# EAGLE design LED Heart (EAGLE 7.3.0)

## Sheet 1 of 2
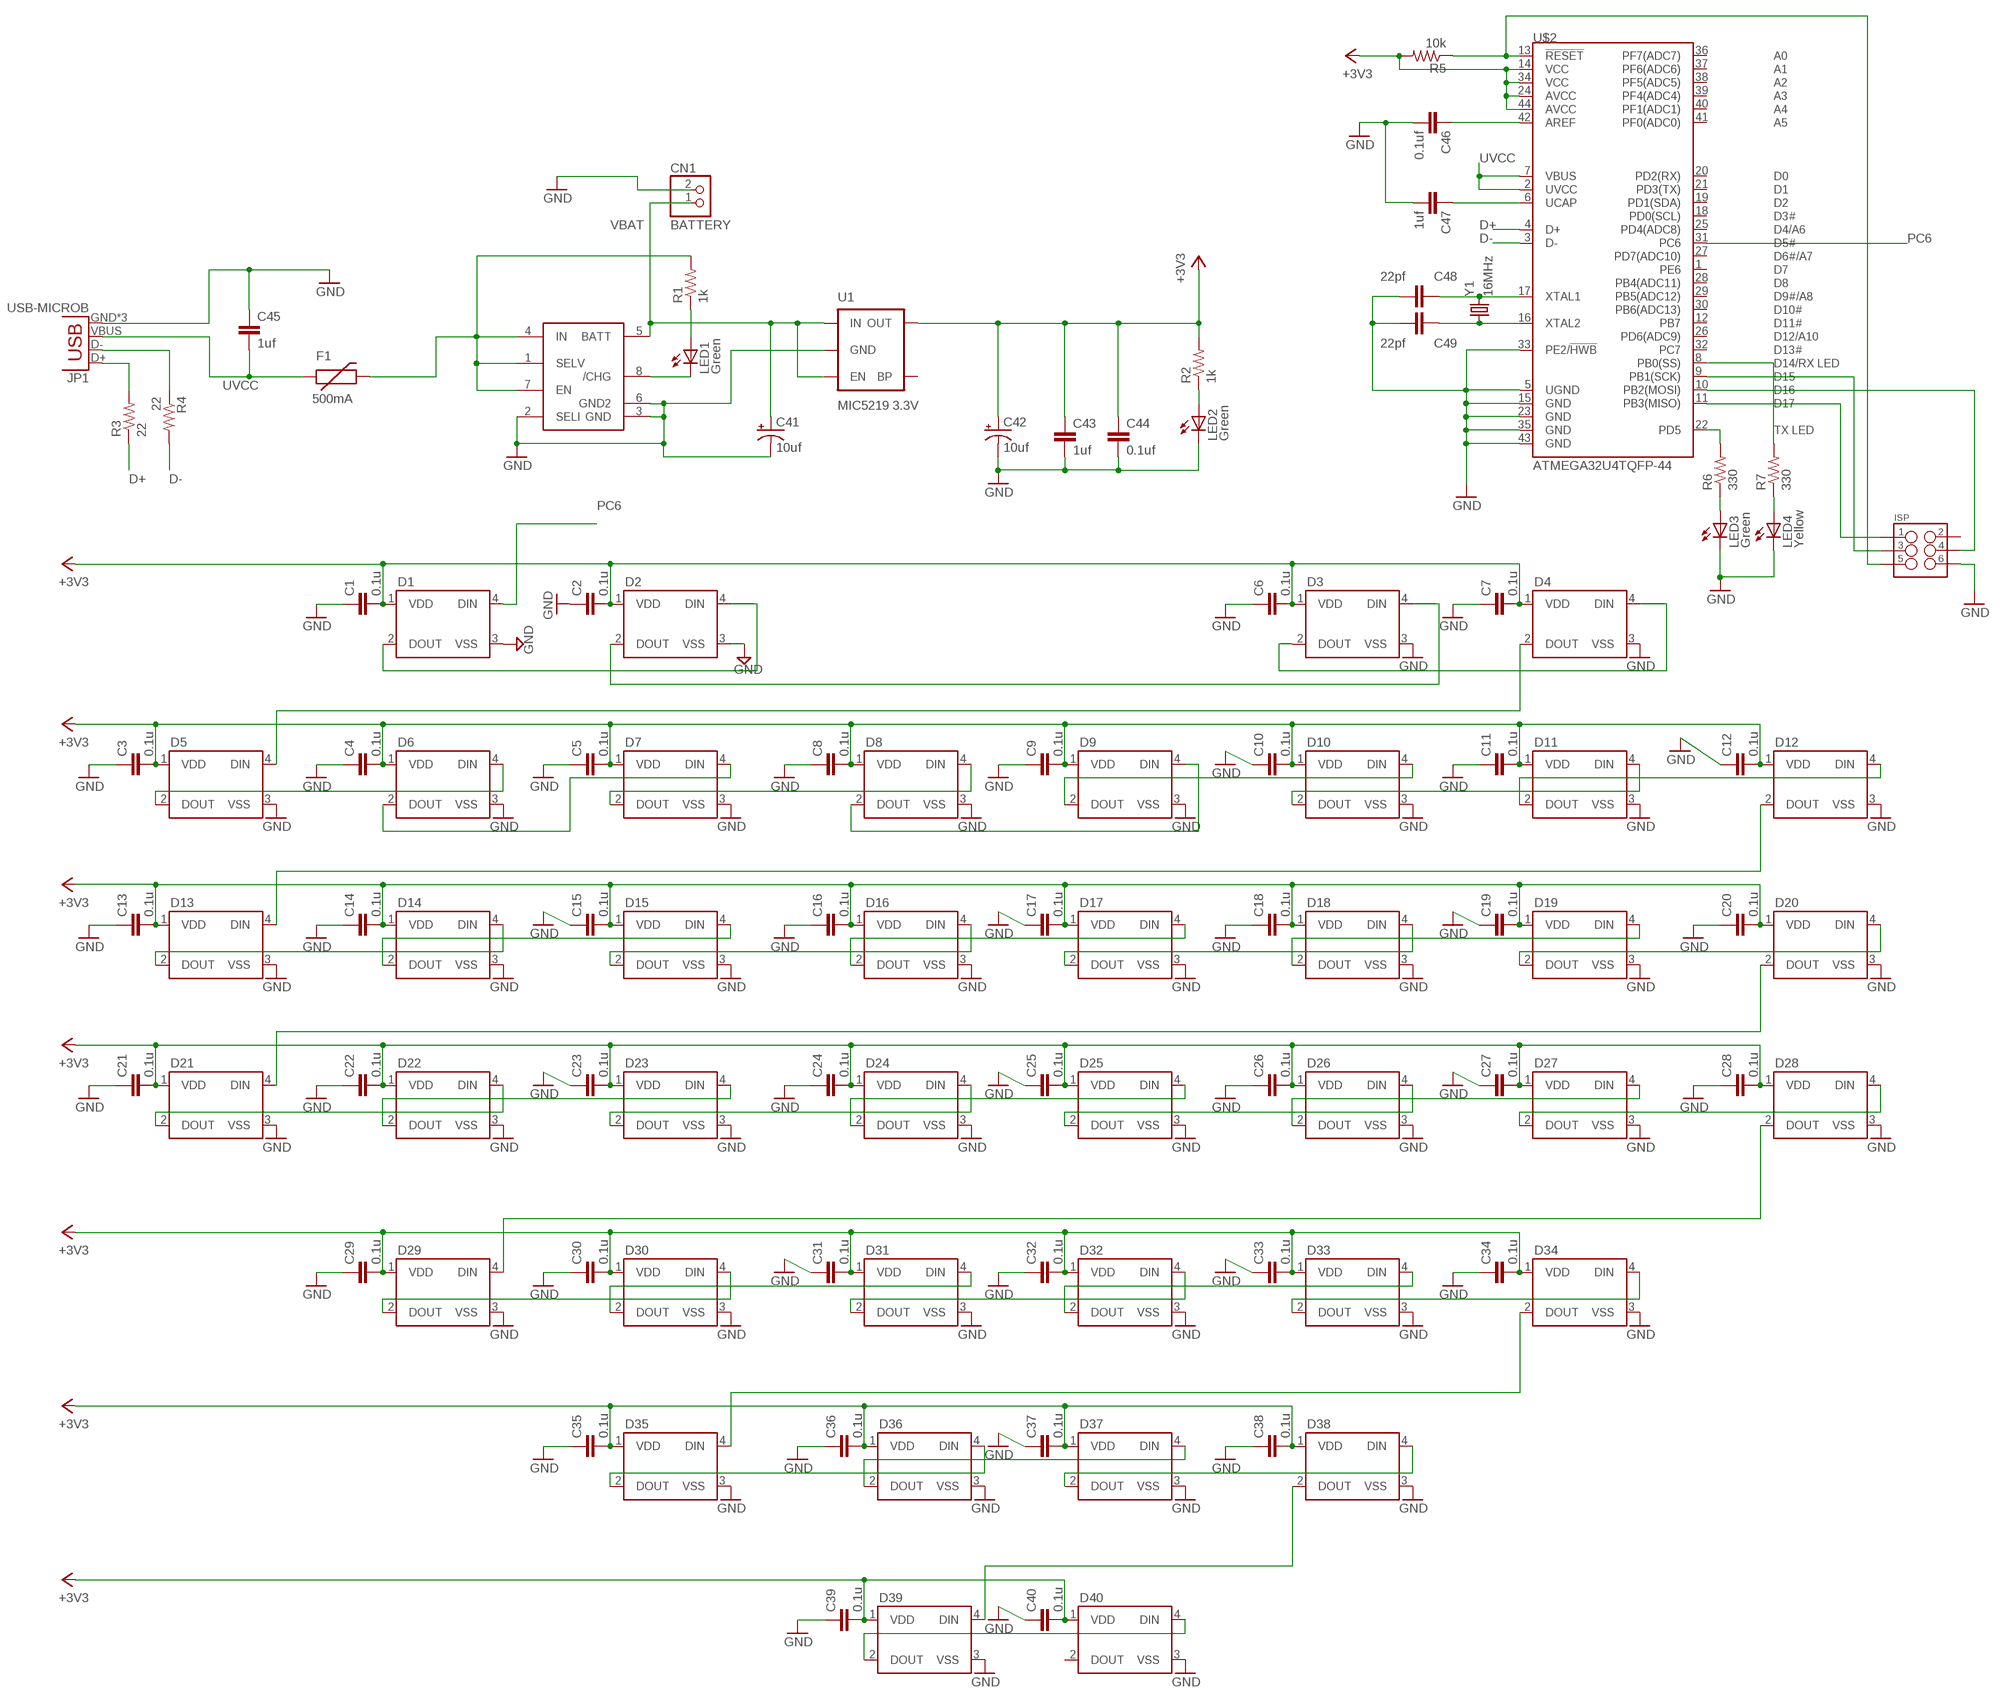
[diagram p0: schematic, sheet 1]

### Parts
C1  0.1u  CAP0805  [0805]
C2  0.1u  CAP0805  [0805]
C3  0.1u  CAP0805  [0805]
C4  0.1u  CAP0805  [0805]
C5  0.1u  CAP0805  [0805]
C6  0.1u  CAP0805  [0805]
C7  0.1u  CAP0805  [0805]
C8  0.1u  CAP0805  [0805]
C9  0.1u  CAP0805  [0805]
C10  0.1u  CAP0805  [0805]
C11  0.1u  CAP0805  [0805]
C12  0.1u  CAP0805  [0805]
C13  0.1u  CAP0805  [0805]
C14  0.1u  CAP0805  [0805]
C15  0.1u  CAP0805  [0805]
C16  0.1u  CAP0805  [0805]
C17  0.1u  CAP0805  [0805]
C18  0.1u  CAP0805  [0805]
C19  0.1u  CAP0805  [0805]
C20  0.1u  CAP0805  [0805]
C21  0.1u  CAP0805  [0805]
C22  0.1u  CAP0805  [0805]
C23  0.1u  CAP0805  [0805]
C24  0.1u  CAP0805  [0805]
C25  0.1u  CAP0805  [0805]
C26  0.1u  CAP0805  [0805]
C27  0.1u  CAP0805  [0805]
C28  0.1u  CAP0805  [0805]
C29  0.1u  CAP0805  [0805]
C30  0.1u  CAP0805  [0805]
C31  0.1u  CAP0805  [0805]
C32  0.1u  CAP0805  [0805]
C33  0.1u  CAP0805  [0805]
C34  0.1u  CAP0805  [0805]
C35  0.1u  CAP0805  [0805]
C36  0.1u  CAP0805  [0805]
C37  0.1u  CAP0805  [0805]
C38  0.1u  CAP0805  [0805]
C39  0.1u  CAP0805  [0805]
C40  0.1u  CAP0805  [0805]
C41  10uf  CAP_POL1206  [EIA3216]
C42  10uf  CAP_POL1206  [EIA3216]
C43  1uf  CAP0805  [0805]
C44  0.1uf  CAP0805  [0805]
C45  1uf  CAP0805  [0805]
C46  0.1uf  CAP0805  [0805]
C47  1uf  CAP0805  [0805]
C48  22pf  CAP0805  [0805]
C49  22pf  CAP0805  [0805]
CN1  BATTERY  JST_2PIN-SMT  [JST-PH-2-SMT]
D1  WS2812B  [WS2812B]
D2  WS2812B  [WS2812B]
D3  WS2812B  [WS2812B]
D4  WS2812B  [WS2812B]
D5  WS2812B  [WS2812B]
D6  WS2812B  [WS2812B]
D7  WS2812B  [WS2812B]
D8  WS2812B  [WS2812B]
D9  WS2812B  [WS2812B]
D10  WS2812B  [WS2812B]
D11  WS2812B  [WS2812B]
D12  WS2812B  [WS2812B]
D13  WS2812B  [WS2812B]
D14  WS2812B  [WS2812B]
D15  WS2812B  [WS2812B]
D16  WS2812B  [WS2812B]
D17  WS2812B  [WS2812B]
D18  WS2812B  [WS2812B]
D19  WS2812B  [WS2812B]
D20  WS2812B  [WS2812B]
D21  WS2812B  [WS2812B]
D22  WS2812B  [WS2812B]
D23  WS2812B  [WS2812B]
D24  WS2812B  [WS2812B]
D25  WS2812B  [WS2812B]
D26  WS2812B  [WS2812B]
D27  WS2812B  [WS2812B]
D28  WS2812B  [WS2812B]
D29  WS2812B  [WS2812B]
D30  WS2812B  [WS2812B]
D31  WS2812B  [WS2812B]
D32  WS2812B  [WS2812B]
D33  WS2812B  [WS2812B]
D34  WS2812B  [WS2812B]
D35  WS2812B  [WS2812B]
D36  WS2812B  [WS2812B]
D37  WS2812B  [WS2812B]
D38  WS2812B  [WS2812B]
D39  WS2812B  [WS2812B]
D40  WS2812B  [WS2812B]
F1  500mA  PTCSMD  [PTC-1206]
ISP  M03X2POGO_PINS  [2X3_POGO]
JP1  USB-MICROB  [USB-MICROB]
LED1  Green  LEDCHIP-LED0805  [CHIP-LED0805]
LED2  Green  LEDCHIP-LED0805  [CHIP-LED0805]
LED3  Green  LEDCHIP-LED0805  [CHIP-LED0805]
LED4  Yellow  LEDCHIP-LED0805  [CHIP-LED0805]
R1  1k  RESISTOR0805-RES  [0805]
R2  1k  RESISTOR0805-RES  [0805]
R3  22  RESISTOR0805-RES  [0805]
R4  22  RESISTOR0805-RES  [0805]
R5  10k  RESISTOR0805-RES  [0805]
R6  330  RESISTOR0805-RES  [0805]
R7  330  RESISTOR0805-RES  [0805]
U1  MIC5219 3.3V  V_REG_MIC52193.3V  [SOT23-5]
U$1  MAX1811SO8  [SO08]
U$2  ATMEGA32U4TQFP-44  [TQFP44]
Y1  16MHz  CRYSTAL7X57X5  [CRYSTAL7X5]

### Nets
+3V3 [supply]: C1.2 C2.2 C3.2 C4.2 C5.2 C6.2 C7.2 C8.2 C9.2 C10.2 C11.2 C12.2 C13.2 C14.2 C15.2 C16.2 C17.2 C18.2 C19.2 C20.2 C21.2 C22.2 C23.2 C24.2 C25.2 C26.2 C27.2 C28.2 C29.2 C30.2 C31.2 C32.2 C33.2 C34.2 C35.2 C36.2 C37.2 C38.2 C39.2 C40.2 C42.A(+) C43.1 C44.1 D1.1(VDD) D2.1(VDD) D3.1(VDD) D4.1(VDD) D5.1(VDD) D6.1(VDD) D7.1(VDD) D8.1(VDD) D9.1(VDD) D10.1(VDD) D11.1(VDD) D12.1(VDD) D13.1(VDD) D14.1(VDD) D15.1(VDD) D16.1(VDD) D17.1(VDD) D18.1(VDD) D19.1(VDD) D20.1(VDD) D21.1(VDD) D22.1(VDD) D23.1(VDD) D24.1(VDD) D25.1(VDD) D26.1(VDD) D27.1(VDD) D28.1(VDD) D29.1(VDD) D30.1(VDD) D31.1(VDD) D32.1(VDD) D33.1(VDD) D34.1(VDD) D35.1(VDD) D36.1(VDD) D37.1(VDD) D38.1(VDD) D39.1(VDD) D40.1(VDD) R2.2 R5.2 U1.5(OUT) U$2.14(VCC) U$2.24(AVCC) U$2.34(VCC) U$2.44(AVCC)
D+: R3.1 U$2.4(D+)
D-: R4.2 U$2.3(D-)
GND [supply]: C1.1 C2.1 C3.1 C4.1 C5.1 C6.1 C7.1 C8.1 C9.1 C10.1 C11.1 C12.1 C13.1 C14.1 C15.1 C16.1 C17.1 C18.1 C19.1 C20.1 C21.1 C22.1 C23.1 C24.1 C25.1 C26.1 C27.1 C28.1 C29.1 C30.1 C31.1 C32.1 C33.1 C34.1 C35.1 C36.1 C37.1 C38.1 C39.1 C40.1 C41.C(-) C42.C(-) C43.2 C44.2 C45.1 C46.2 C47.2 C48.2 C49.2 CN1.2 D1.3(VSS) D2.3(VSS) D3.3(VSS) D4.3(VSS) D5.3(VSS) D6.3(VSS) D7.3(VSS) D8.3(VSS) D9.3(VSS) D10.3(VSS) D11.3(VSS) D12.3(VSS) D13.3(VSS) D14.3(VSS) D15.3(VSS) D16.3(VSS) D17.3(VSS) D18.3(VSS) D19.3(VSS) D20.3(VSS) D21.3(VSS) D22.3(VSS) D23.3(VSS) D24.3(VSS) D25.3(VSS) D26.3(VSS) D27.3(VSS) D28.3(VSS) D29.3(VSS) D30.3(VSS) D31.3(VSS) D32.3(VSS) D33.3(VSS) D34.3(VSS) D35.3(VSS) D36.3(VSS) D37.3(VSS) D38.3(VSS) D39.3(VSS) D40.3(VSS) ISP.P$6 JP1.GND JP1.MT1(GND) JP1.MT2(GND) LED2.C LED3.C LED4.C U1.2(GND) U$1.2(SELI) U$1.3(GND) U$1.6(GND2) U$2.5(UGND) U$2.15(GND) U$2.23(GND) U$2.33(PE2/!HWB) U$2.35(GND) U$2.43(GND)
N$1: D1.2(DOUT) D2.4(DIN)
N$2: D2.2(DOUT) D3.4(DIN)
N$3: D3.2(DOUT) D4.4(DIN)
N$4: D4.2(DOUT) D5.4(DIN)
N$5: D5.2(DOUT) D6.4(DIN)
N$6: D6.2(DOUT) D7.4(DIN)
N$7: D7.2(DOUT) D8.4(DIN)
N$8: D8.2(DOUT) D9.4(DIN)
N$9: D9.2(DOUT) D10.4(DIN)
N$10: D10.2(DOUT) D11.4(DIN)
N$11: D11.2(DOUT) D12.4(DIN)
N$12: D12.2(DOUT) D13.4(DIN)
N$13: D13.2(DOUT) D14.4(DIN)
N$14: D14.2(DOUT) D15.4(DIN)
N$15: D15.2(DOUT) D16.4(DIN)
N$16: D16.2(DOUT) D17.4(DIN)
N$17: D17.2(DOUT) D18.4(DIN)
N$18: D18.2(DOUT) D19.4(DIN)
N$19: D19.2(DOUT) D20.4(DIN)
N$20: D20.2(DOUT) D21.4(DIN)
N$21: D21.2(DOUT) D22.4(DIN)
N$22: D22.2(DOUT) D23.4(DIN)
N$23: D23.2(DOUT) D24.4(DIN)
N$24: D24.2(DOUT) D25.4(DIN)
N$25: D25.2(DOUT) D26.4(DIN)
N$26: D26.2(DOUT) D27.4(DIN)
N$27: D27.2(DOUT) D28.4(DIN)
N$28: D28.2(DOUT) D29.4(DIN)
N$29: D29.2(DOUT) D30.4(DIN)
N$30: D30.2(DOUT) D31.4(DIN)
N$31: D31.2(DOUT) D32.4(DIN)
N$32: D32.2(DOUT) D33.4(DIN)
N$33: D33.2(DOUT) D34.4(DIN)
N$34: D34.2(DOUT) D35.4(DIN)
N$35: D35.2(DOUT) D36.4(DIN)
N$36: D36.2(DOUT) D37.4(DIN)
N$37: D37.2(DOUT) D38.4(DIN)
N$38: D38.2(DOUT) D39.4(DIN)
N$39: D39.2(DOUT) D40.4(DIN)
N$40 [supply]: F1.2 R1.2 U$1.1(SELV) U$1.4(IN) U$1.7(EN)
N$41: JP1.D+ R3.2
N$42: JP1.D- R4.1
N$43: ISP.P$5 R5.1 U$2.13(!RESET)
N$44: C46.1 U$2.42(AREF)
N$45: LED1.C U$1.8(/CHG)
N$46: LED1.A R1.1
N$47: LED2.A R2.1
N$48: C47.1 U$2.6(UCAP)
N$49: C48.1 U$2.17(XTAL1) Y1.3
N$50: C49.1 U$2.16(XTAL2) Y1.1
N$51: ISP.P$1 U$2.11(PB3(MISO))
N$52: ISP.P$3 U$2.9(PB1(SCK))
N$53: ISP.P$4 U$2.10(PB2(MOSI))
N$54: LED3.A R6.1
N$55: R6.2 U$2.22(PD5)
N$57: LED4.A R7.1
N$58: R7.2 U$2.8(PB0(SS))
PC6: D1.4(DIN) U$2.31(PC6)
UVCC [supply]: C45.2 F1.1 JP1.VBUS U$2.2(UVCC) U$2.7(VBUS)
VBAT [supply]: C41.A(+) CN1.1 U1.1(IN) U1.3(EN) U$1.5(BATT)
Unconnected: D40.2(DOUT) ISP.P$2 U1.4(BP) U$2.1(PE6) U$2.12(PB7) U$2.18(PD0(SCL)) U$2.19(PD1(SDA)) U$2.20(PD2(RX)) U$2.21(PD3(TX)) U$2.25(PD4(ADC8)) U$2.26(PD6(ADC9)) U$2.27(PD7(ADC10)) U$2.28(PB4(ADC11)) U$2.29(PB5(ADC12)) U$2.30(PB6(ADC13)) U$2.32(PC7) U$2.36(PF7(ADC7)) U$2.37(PF6(ADC6)) U$2.38(PF5(ADC5)) U$2.39(PF4(ADC4)) U$2.40(PF1(ADC1)) U$2.41(PF0(ADC0))

## Sheet 2 of 2

## Library data of the parts
C1-C40 C43-C49 = SparkFun-Capacitors:CAP: Capacitor Standard 0603 ceramic capacitor, and 0.1" leaded capacitor.
C41 C42 = SparkFun-Capacitors:CAP_POL: Capacitor Polarized These are standard SMD and PTH capacitors. Normally 10uF, 47uF, and 100uF in electrolytic and tantalum varieties. Always verify the external diameter of the through hole cap, it varies with capacity, voltage, and manufacturer. The EIA devices should be standard.
CN1 = adafruit:JST_2PIN: JST 2-Pin Connectors of various flavors SMT-RA (S2B-PH-SM4) 4UConnector #17311 SMT (B2B-PH-SM4) THM-RA (S2B-PH) THM (B2B-PH)
D1-D40 = SparkFun-LED:WS2812B: WS2812B - Intelligent control LED integrated light source Technical Specifications: Power Supply Voltage (VDD): 3.5 to 5.3 V Input Voltage (VI): -0.5 to VDD+0.5 V Operating Junction Temperature (Topt): -25°C to +80°C Storage Temperature Range (Tstg): -55°C to +150°C; PROD_ID: DIO-12503
F1 = SparkFun-PowerIC:PTC: Resettable Fuse PTC Resettable Fuse. Spark Fun Electronics SKU : COM-08357; PROD_ID: RES-11150
ISP = SparkFun-Connectors:M03X2: 2x3 .1" header. Shrouded, with keying- CONN-10681 SMT- CONN-11415 Pogo pins- HW-11044; PROD_ID: HW-11044
JP1 = SparkFun-Connectors:USB: USB Connectors USB-B-PTH is fully proven SKU : PRT-00139/CONN-08278 USB-miniB is fully proven SKU : PRT-00587 USB-A-PCB is untested. USB-A-H is throughly reviewed, but untested. Spark Fun Electronics SKU : PRT-00437 USB-B-SMT is throughly reviewed, but untested. Needs silkscreen touching up. USB-A-S has not been used/tested USB-MB-H has not been used/tested USB-MICROB has been used. CONN-09505; PROD_ID: CONN-09505
LED1-LED4 = adafruit:LED: LED OSRAM: - CHIPLED LG R971, LG N971, LY N971, LG Q971, LY Q971, LO R971, LY R971 LH N974, LH R974 LS Q976, LO Q976, LY Q976 LO Q996 - Hyper CHIPLED LW Q18S LB Q993, LB Q99A, LB R99A - SideLED LS A670, LO A670, LY A670, LG A670, LP A670 LB A673, LV A673, LT A673, LW A673 LH A674 LY A675 LS A676, LA A676, LO A676, LY A676, LW A676 LS A679, LY A679, LG A679 - Hyper Micro SIDELED® LS Y876, LA Y876, LO Y876, LY Y876 LT Y87S - SmartLED LW L88C, LW L88S LB L89C, LB L89S, LG L890 LS L89K, LO L89K, LY L89K LS L896, LA L896, LO L896, LY L896 - TOPLED LS T670, LO T670, LY T670, LG T670, LP T670 LSG T670, LSP T670, LSY T670, LOP T670, LYG T670 LG T671, LOG T671, LSG T671 LB T673, LV T673, LT T673, LW T673 LH T674 LS T676, LA T676, LO T676, LY T676, LB T676, LH T676, LSB T676, LW T676 LB T67C, LV T67C, LT T67C, LS T67K, LO T67K, LY T67K, LW E67C LS E67B, LA E67B, LO E67B, LY E67B, LB E67C, LV E67C, LT E67C LW T67C LS T679, LY T679, LG T679 LS T770, LO T770, LY T770, LG T770, LP T770 LB T773, LV T773, LT T773, LW T773 LH T774 LS E675, LA E675, LY E675, LS T675 LS T776, LA T776, LO T776, LY T776, LB T776 LHGB T686 LT T68C, LB T68C - Hyper Mini TOPLED® LB M676 - Mini TOPLED Santana® LG M470 LS M47K, LO M47K, LY M47K Source: http://www.osram.convergy.de/
R1-R7 = SparkFun-Passives:RESISTOR: Resistor Basic schematic elements and footprints for 0603, 1206, and PTH resistors.
U1 = SparkFun-PowerIC:V_REG_MIC5219: V_REG MIC5219 Standard 3.3V and 5V 500mA LDO voltage regulator in SOT-23 layout. Micrel part MIC5219. BP (by-pass) pin is used to lower output noise with 470pF cap, may be left open.; PROD_ID: VREG-09872
U$1 = adafruit:MAX1811: Maxim MAX1811 USB li-ion battery charger http://www.ladyada.net/library/eagle
U$2 = SparkFun-DigitalIC:ATMEGA32U4: Atmel 44-pin 8-bit Microcontroller with 32KBytes of ISP Flash and USB Controller
Y1 = eagle-library:CRYSTAL7X5: Abracon ABMM crystal

## Net classes
1 supply: width 0.508 mm

## Board
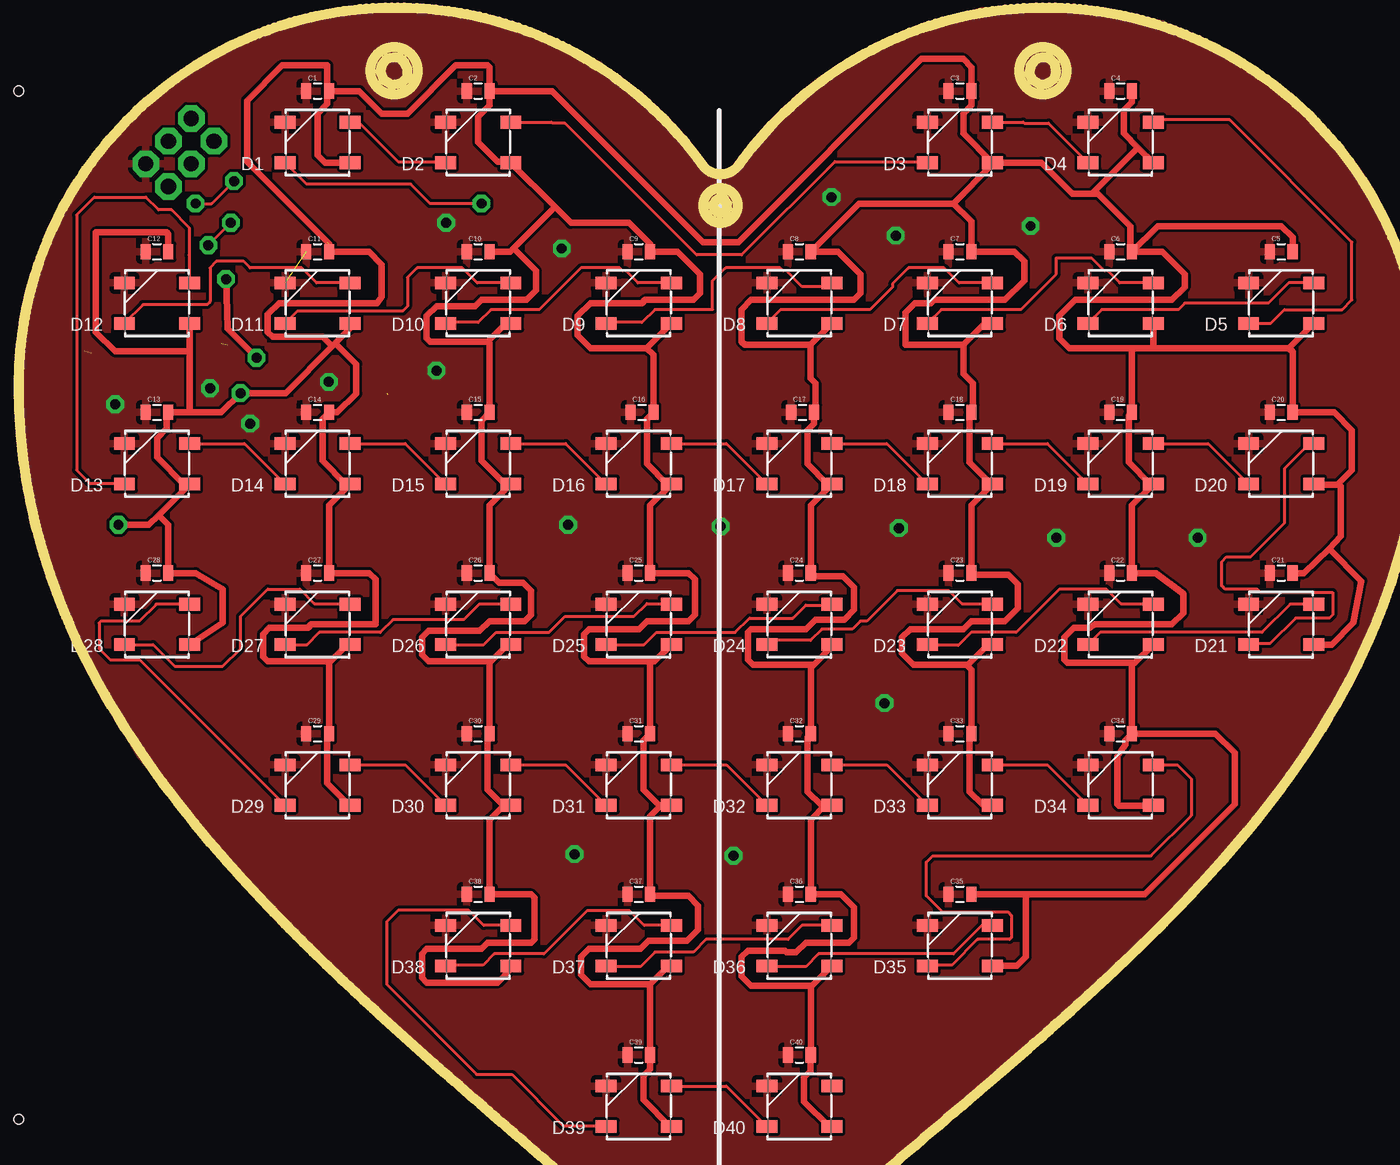
[diagram p1: board, top side]
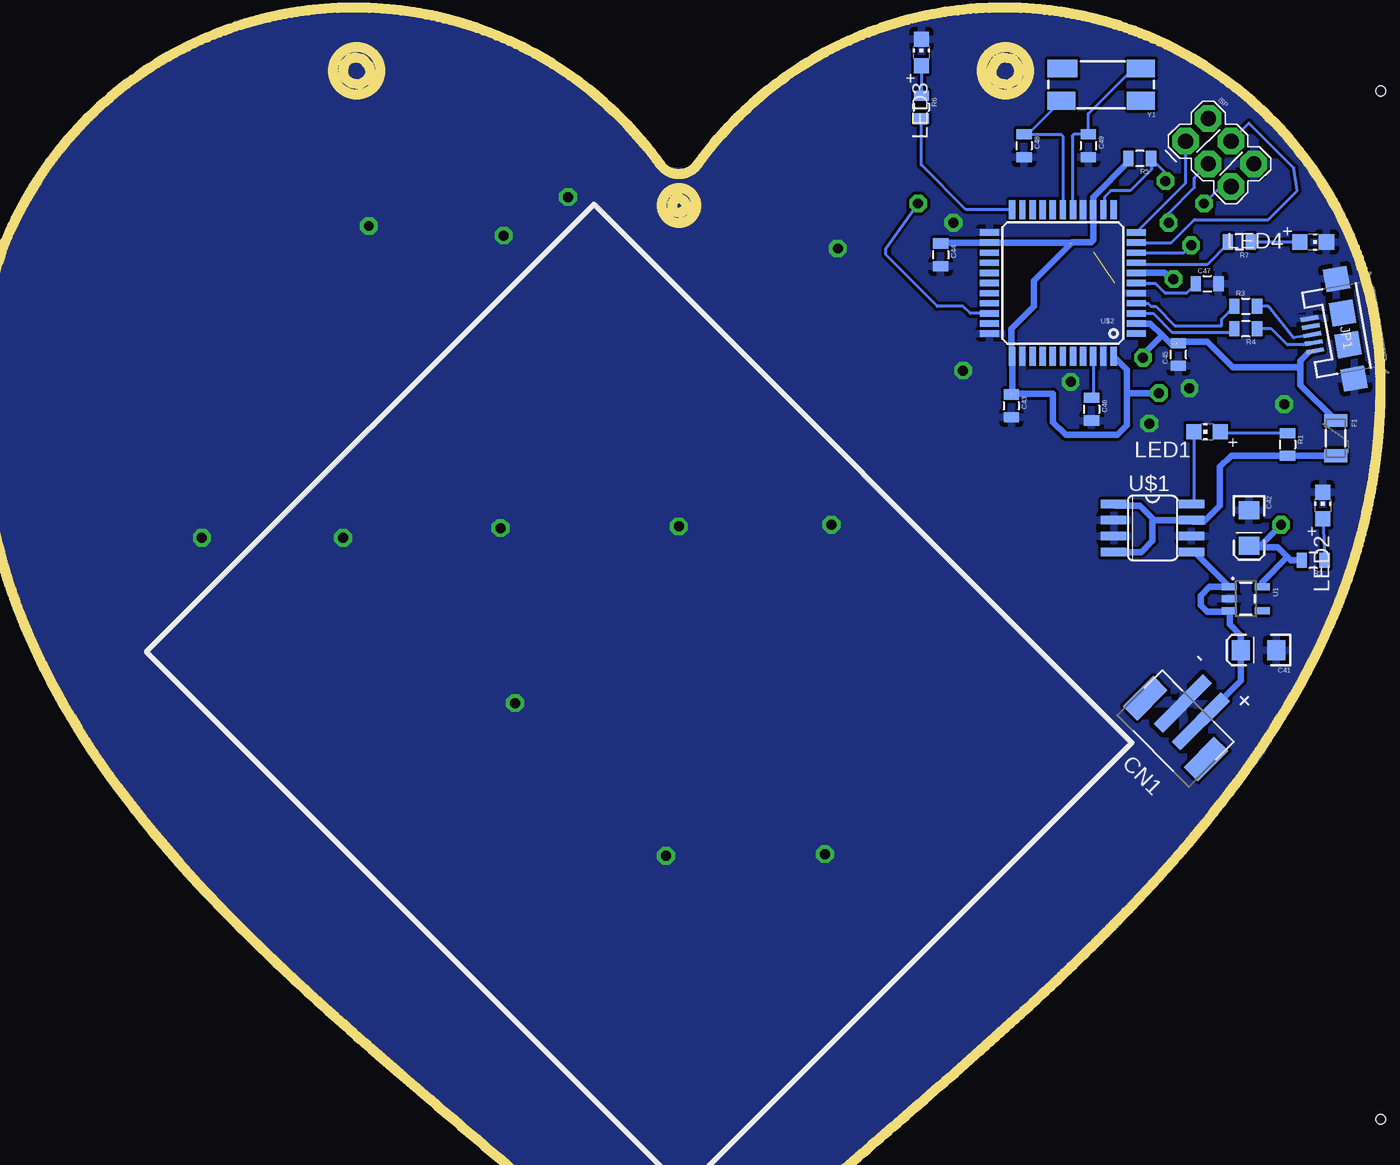
[diagram p2: board, bottom side, seen from below]

No outline drawn. Coordinates in mm, seen from the top.
Copper layers (1*16): Top 0.035mm / dielectric 1.5mm / Bottom 0.035mm
Design rules "default *": minimum track width 10mil, minimum drill 31mil, track to track 9mil, track to pad 9mil, pad to pad 9mil, via to via 9mil, smd to smd 9mil, copper to edge 40mil, drill to drill 8mil, minimum pad ring 12mil, minimum via ring 12mil, stop-mask expansion 4mil, vias tented up to drill 0mil, thermal gap 15mil
Holes 0.79 mm at 0,0 0,96.52 111.76,96.52 111.76,0 111.76,15.24 0,15.24
Milling: area 27.8,96.3 to 31.5,100; area 79.1,96.3 to 82.8,100; area 53.6,4.7 to 57.4,8.4; area 54.1,86.1 to 56.8,88.8; 1092 lines

### Footprints (pad centres in the part's own frame; a part is rotated, then mirrored left to right if it is on the bottom)
0805 = smd 0.8 x 1.2: 1 -0.9,0; 2 0.9,0
EIA3216 = smd 1.4 x 1.6: A 1.4,0; C -1.4,0
JST-PH-2-SMT = smd 1 x 5.5: 1 -1,-1.8; 2 1,-1.8 | smd 1.6 x 3.4: NC1 -3.4,0; NC2 3.4,0
WS2812B = smd 1.651 x 1: 1 -2.577,1.6; 2 -2.577,-1.6; 3 2.577,-1.6; 4 2.577,1.6
PTC-1206 = smd 1 x 1.8: 1 -1.4,0; 2 1.4,0
2X3_POGO = drill 1.2 pad 1.829 octagon: P$1 0,0; P$2 0,2.54; P$3 2.54,0; P$4 2.54,2.54; P$5 5.08,0; P$6 5.08,2.54
USB-MICROB = smd 0.35 x 1.4: D+ 0,2.65; D- -0.65,2.65; GND 1.3,2.65; ID 0.65,2.65; VBUS -1.3,2.65 | smd 1.8 x 1.9: MT1 -4,0; MT2 4,0 | smd 1.9 x 1.9: P$1 -1.27,0; P$2 1.27,0
CHIP-LED0805 = smd 1.2 x 1.2: A 0,-1.05; C 0,1.05
SOT23-5 = smd 0.55 x 1.2: 1 -0.95,-1.3; 2 0,-1.3; 3 0.95,-1.3; 4 0.95,1.3; 5 -0.95,1.3
SO08 = smd 0.66 x 2.032: 1 -1.905,-3.073; 2 -0.635,-3.073; 3 0.635,-3.073; 4 1.905,-3.073; 5 1.905,3.073; 6 0.635,3.073; 7 -0.635,3.073; 8 -1.905,3.073
TQFP44 = smd 1.5 x 0.5: 1 -5.8,4; 2 -5.8,3.2; 3 -5.8,2.4; 4 -5.8,1.6; 5 -5.8,0.8; 6 -5.8,0; 7 -5.8,-0.8; 8 -5.8,-1.6; 9 -5.8,-2.4; 10 -5.8,-3.2; 11 -5.8,-4; 23 5.8,-4; 24 5.8,-3.2; 25 5.8,-2.4; 26 5.8,-1.6; 27 5.8,-0.8; 28 5.8,0; 29 5.8,0.8; 30 5.8,1.6; 31 5.8,2.4; 32 5.8,3.2; 33 5.8,4 | smd 0.5 x 1.5: 12 -4,-5.8; 13 -3.2,-5.8; 14 -2.4,-5.8; 15 -1.6,-5.8; 16 -0.8,-5.8; 17 0,-5.8; 18 0.8,-5.8; 19 1.6,-5.8; 20 2.4,-5.8; 21 3.2,-5.8; 22 4,-5.8; 34 4,5.8; 35 3.2,5.8; 36 2.4,5.8; 37 1.6,5.8; 38 0.8,5.8; 39 0,5.8; 40 -0.8,5.8; 41 -1.6,5.8; 42 -2.4,5.8; 43 -3.2,5.8; 44 -4,5.8
CRYSTAL7X5 = smd 2.21 x 1.397: 1 -3.15,-1.27; 2 -3.15,1.27; 3 3.15,1.27 | smd 2.388 x 1.397: 4 3.061,-1.27

### Placement (x,y rotation side)
C1  23.62,96.52 0 top
C2  36.32,96.52 0 top
C3  74.42,96.52 0 top
C4  87.12,96.52 0 top
C5  99.82,83.82 0 top
C6  87.12,83.82 0 top
C7  74.42,83.82 0 top
C8  61.72,83.82 0 top
C9  49.02,83.82 0 top
C10  36.32,83.82 0 top
C11  23.62,83.82 0 top
C12  10.92,83.82 0 top
C13  10.92,71.12 0 top
C14  23.62,71.12 0 top
C15  36.32,71.12 0 top
C16  49.28,71.12 0 top
C17  61.98,71.12 0 top
C18  74.42,71.12 0 top
C19  87.12,71.12 0 top
C20  99.82,71.12 0 top
C21  99.82,58.42 0 top
C22  87.12,58.42 0 top
C23  74.42,58.42 0 top
C24  61.72,58.42 0 top
C25  49.02,58.42 0 top
C26  36.32,58.42 0 top
C27  23.62,58.42 0 top
C28  10.92,58.42 0 top
C29  23.62,45.72 0 top
C30  36.32,45.72 0 top
C31  49.02,45.72 0 top
C32  61.72,45.72 0 top
C33  74.42,45.72 0 top
C34  87.12,45.72 0 top
C35  74.42,33.02 0 top
C36  61.72,33.02 0 top
C37  49.02,33.02 0 top
C38  36.32,33.02 0 top
C39  49.02,20.32 0 top
C40  61.72,20.32 0 top
C41  9.65,52.32 180 bottom
C42  10.41,61.98 270 bottom
C43  29.21,71.63 270 bottom
C44  34.8,83.57 270 bottom
C45  16,75.69 90 bottom
C46  22.86,71.37 270 bottom
C47  13.72,81.28 0 bottom
C48  28.19,92.2 270 bottom
C49  23.11,92.2 270 bottom
CN1  16.21,46.12 135 bottom
D1  23.62,92.46 180 top
D2  36.32,92.46 180 top
D3  74.42,92.46 180 top
D4  87.12,92.46 180 top
D5  99.82,79.76 180 top
D6  87.12,79.76 180 top
D7  74.42,79.76 180 top
D8  61.72,79.76 180 top
D9  49.02,79.76 180 top
D10  36.32,79.76 180 top
D11  23.62,79.76 180 top
D12  10.92,79.76 180 top
D13  10.92,67.06 180 top
D14  23.62,67.06 180 top
D15  36.32,67.06 180 top
D16  49.02,67.06 180 top
D17  61.72,67.06 180 top
D18  74.42,67.06 180 top
D19  87.12,67.06 180 top
D20  99.82,67.06 180 top
D21  99.82,54.36 180 top
D22  87.12,54.36 180 top
D23  74.42,54.36 180 top
D24  61.72,54.36 180 top
D25  49.02,54.36 180 top
D26  36.32,54.36 180 top
D27  23.62,54.36 180 top
D28  10.92,54.36 180 top
D29  23.62,41.66 180 top
D30  36.32,41.66 180 top
D31  49.02,41.66 180 top
D32  61.72,41.66 180 top
D33  74.42,41.66 180 top
D34  87.12,41.66 180 top
D35  74.42,28.96 180 top
D36  61.72,28.96 180 top
D37  49.02,28.96 180 top
D38  36.32,28.96 180 top
D39  49.02,16.26 180 top
D40  61.72,16.26 180 top
F1  3.56,69.09 270 bottom
ISP  15.42,92.56 315 bottom
JP1  2.79,77.72 100 bottom
LED1  13.72,69.6 90 bottom
LED2  4.57,63.75 0 bottom
LED3  36.32,99.57 0 bottom
LED4  5.33,84.58 270 bottom
R1  7.37,68.58 270 bottom
R2  5.33,59.44 180 bottom
R3  10.67,79.5 0 bottom
R4  10.67,77.72 180 bottom
R5  19.05,91.19 180 bottom
R6  36.32,95.25 270 bottom
R7  11.18,84.58 180 bottom
U1  10.67,56.39 270 bottom
U$1  18.03,61.98 270 bottom
U$2  25.13,81.34 180 bottom
Y1  22.1,97.03 180 bottom

### Tracks (layer width: path | path; a pad name or v marks a point on that pad's centre or on a via)
+3V3  (via drill 0.79)  (2 unrouted)
  Top 0.508: v7.87,62.23 10.27,62.23 11.04,63 | 11.04,63 D13.1 13.03,65.46 10.92,67.56 10.92,69.09 11.68,69.85 11.68,70.98 C13.2 13.46,71.12 | 13.46,71.12 16,71.12 v17.53,72.64 21.08,72.64 24.77,76.33 | D12.1 13.5,75.95 | 13.5,75.95 13.5,71.16 13.46,71.12 | C12.2 11.82,85.21 11.68,85.34 6.1,85.34 6.1,77.47 7.62,75.95 13.5,75.95 | D11.1 26.2,77.76 25.02,76.58 | 25.02,76.58 24.77,76.33 | C1.2 24.38,96.66 24.38,98.55 20.83,98.55 18.03,95.76 18.03,90.93 24.52,84.44 C11.2 27.69,83.82 28.7,82.8 28.7,80.26 28.32,79.76 20.57,79.76 19.68,78.87 19.68,77.47 20.07,77.09 24,77.09 24.77,76.33 | D1.1 24.21,90.86 23.62,91.44 23.62,94.74 24.38,95.5 24.38,96.38 C1.2 | C2.2 37.22,98.41 37.08,98.55 34.54,98.55 30.73,94.74 28.7,94.74 26.92,96.52 C1.2 | C2.2 37.22,95.39 36.32,94.49 36.32,92.46 37.85,90.93 38.82,90.93 D2.1 42.4,87.36 | C2.2 42.16,96.52 54.1,84.58 56.9,84.58 71.37,99.06 74.68,99.06 75.32,98.41 C3.2 75.32,95.39 74.68,94.74 74.68,93.18 D3.1 | 42.4,87.36 43.65,86.11 48.26,86.11 49.92,84.44 C9.2 52.07,83.82 53.85,82.04 53.85,80.52 53.34,80.01 49.53,80.01 49.28,79.76 45.21,79.76 44.2,78.74 44.2,77.22 45.21,76.2 49.64,76.2 | 49.64,76.2 D9.1 | D3.1 77,90.72 73.91,87.63 | 73.91,87.63 66.43,87.63 C8.2 64.77,83.82 66.55,82.04 66.55,80.52 66.04,80.01 57.91,80.01 57.15,79.25 57.15,76.71 57.4,76.45 62.6,76.45 | C10.2 38.86,83.82 39.12,84.07 | 39.12,84.07 42.4,87.36 | C4.2 88.02,95.64 87.38,95 87.38,93.18 88.5,92.06 | 88.5,92.06 D4.1 | D3.1 80.85,90.86 83.31,88.39 84.84,88.39 | 84.84,88.39 88.5,92.06 | 84.84,88.39 85.34,88.39 87.88,85.85 87.88,83.96 C6.2 | C5.2 100.72,84.95 99.82,85.85 90.05,85.85 C6.2
  Top 0.508: C6.2 90.42,83.82 92.2,82.04 92.2,81.03 91.19,80.01 83.57,80.01 82.3,78.74 82.3,76.96 83.06,76.2 87.88,76.2 | 87.88,76.2 89.66,76.2 | 89.66,76.2 100.44,76.2 | 100.44,76.2 D5.1 | D6.1 89.7,76.24 89.66,76.2 | 73.91,87.63 75.32,86.22 C7.2 78.74,83.82 79.5,83.06 79.5,81.53 77.98,80.01 72.39,80.01 72.14,79.76 70.87,79.76 70.1,78.99 70.1,76.45 74.68,76.45 | 62.6,76.45 D8.1 | 87.88,76.2 88.02,76.06 C19.2 87.76,70.86 87.76,67.18 89.48,65.46 D19.1 88.02,63.78 C22.2 89.92,58.42 92.08,56.77 92.08,55.24 91.19,54.36 85.09,54.36 84.71,54.1 83.44,54.1 82.68,53.34 82.68,51.56 82.93,51.31 88.01,51.31 | 100.44,76.2 100.72,75.92 C20.2 104.01,71.12 105.41,69.72 105.41,66.55 104.33,65.47 | D7.1 76.38,78.16 74.68,76.45 | 74.68,76.45 74.68,74.17 75.44,73.41 75.44,71.24 C18.2 75.18,70.98 75.18,67.18 76.91,65.46 D18.1 75.32,63.78 C23.2 75.45,58.29 78.23,58.29 78.99,57.53 78.99,55.63 77.98,54.61 75.31,54.61 74.68,53.98 70.48,53.98 69.85,53.34 69.85,52.07 70.74,51.18 74.93,51.18 | 62.6,76.45 62.6,73.8 62.99,73.41 62.99,71.24 C17.2 62.87,71.11 62.87,70.23 62.36,69.72 62.36,67.06 63.96,65.46 D17.1 62.62,63.78 C24.2 62.88,58.17 65.15,58.17 66.04,57.28 66.04,55.5 65.28,54.74 62.99,54.74 62.23,53.98 57.91,53.98 57.66,53.72 57.66,51.56 58.04,51.18 62.87,51.18 | 49.64,76.2 50.18,75.67 C16.2 49.66,70.6 49.66,67.06 51.26,65.46 D16.1 49.92,63.78 C25.2 52.96,58.42 53.47,57.91 53.47,55.12 52.96,54.61 49.66,54.61 49.02,53.98 45.09,53.98 44.7,53.59 44.7,51.82 45.09,51.44 50.04,51.44 | D10.1 38.53,78.16 37.08,76.71 | 37.08,76.71 32.51,76.71 32.26,76.96 32.26,78.74 33.02,79.5 36.07,79.5 36.58,80.01 40.13,80.01 40.89,80.77 40.89,82.3 39.12,84.07
  Top 0.508: 37.08,76.71 37.22,76.57 C15.2 36.58,70.47 36.58,67.31 38.43,65.46 D15.1 37.22,63.78 C26.2 37.98,57.66 39.88,57.66 40.51,57.02 40.51,55.12 40.01,54.61 37.21,54.61 36.45,53.85 32.38,53.85 31.88,53.34 31.88,51.94 32.38,51.44 37.21,51.44 | 25.02,76.58 26.67,74.93 26.67,72.61 25.18,71.12 C14.2 24,70.6 24,67.31 25.86,65.46 D14.1 24.52,63.78 C27.2 27.69,58.42 28.19,57.91 28.19,54.36 23.11,54.36 22.86,54.1 19.81,54.1 19.3,53.59 19.3,51.82 19.68,51.44 24.64,51.44 | 104.33,65.47 104.27,65.41 102.45,65.41 D20.1 | 11.04,63 11.82,62.22 C28.2 13.97,58.42 16.13,57.15 16.13,54.5 D28.1 | C21.2 101.6,58.42 103.63,60.33 | 103.63,60.33 104.52,61.34 104.52,65.28 104.33,65.47 | D21.1 103.81,52.76 105.54,54.48 106.17,57.78 103.63,60.33 | 88.01,51.31 88.25,51.31 D22.1 | D23.1 76.63,52.76 75.06,51.18 74.93,51.18 | D24.1 64.3,52.62 62.87,51.18 | 50.04,51.44 50.28,51.44 D25.1 | D26.1 38.66,52.76 37.34,51.44 37.21,51.44 | D27.1 25.96,52.76 24.64,51.44 | 24.64,51.44 24.52,51.32 C29.2 24.38,45.58 24.38,41.78 26.11,40.06 D29.1 | 37.21,51.44 37.22,51.42 C30.2 37.08,45.58 37.08,41.27 38.3,40.06 38.35,40.06 | 50.04,51.44 49.92,51.32 C31.2 49.4,45.2 49.4,41.27 50.62,40.06 50.8,40.06 | 62.87,51.18 62.62,50.94 C32.2 62.36,45.45 62.36,41.15 63.45,40.06 63.75,40.06 | 74.93,51.18 75.32,50.79 C33.2 75.18,45.58 75.18,41.15 76.28,40.06 D33.1 | C34.2 88.02,51.3 88.01,51.31 | D30.1 38.35,40.06 | D31.1 50.8,40.06 | D32.1 63.75,40.06 | D34.1 89.74,40.06 89.79,40.01 87,40.01 86.87,40.13 86.87,43.94 87.5,44.83 87.5,45.2 C34.2 | 38.35,40.06 37.22,38.92 C38.2 40.51,33.02 40.77,32.77 40.77,29.46 40.51,29.21 37.08,29.21 36.58,28.7 32.26,28.7 31.88,28.32 31.88,26.42 32.26,26.04 37.85,26.04 38.9,27.09 D38.1
  Top 0.508: 50.8,40.06 49.92,39.18 C37.2 50.05,32.89 52.96,32.89 53.72,32.13 53.72,30.23 52.83,29.34 49.78,29.34 49.15,28.7 45.09,28.7 44.45,28.07 44.45,26.67 45.21,25.91 49.91,25.91 | 63.75,40.06 62.62,38.92 C36.2 65.02,33.02 66.04,32 66.04,29.59 65.66,29.21 62.23,29.21 61.47,28.45 60.71,28.45 60.58,28.57 57.66,28.57 57.15,28.07 57.15,26.54 57.91,25.78 62.72,25.78 | C35.2 79.76,33.02 | 79.76,33.02 89.03,33.02 96.14,40.13 96.14,44.2 94.61,45.72 C34.2 | D35.1 78.92,27.36 79.63,28.07 79.63,32.89 79.76,33.02 | 62.72,25.78 D36.1 | D37.1 51.36,27.36 49.91,25.91 | D39.1 51.51,14.66 49.4,16.76 49.4,18.67 49.91,19.18 C39.2 49.92,25.9 49.91,25.91 | 62.72,25.78 62.62,25.68 C40.2 62.61,19.05 62.1,18.54 62.1,16.64 64.08,14.66 D40.1
  Bottom 0.508: 34.8,84.54 U$2.24 24.42,84.54 | U$2.34 29.13,72.61 25.94,72.61 25.91,72.58 25.91,70.36 24.89,69.34 20.83,69.34 20.07,70.1 20.07,72.64 | 20.07,72.64 20.07,74.48 U$2.44 | 24.42,84.54 27.43,81.53 27.43,79.5 29.21,77.72 29.21,76.45 | R2.2 7.11,59.44 7.37,59.69 | 7.37,59.69 8.13,60.45 10.29,60.45 C42.A 9.53,60.58 v7.87,62.23 | U1.5 9.37,57.69 7.37,59.69 | v17.53,72.64 20.07,72.64 | 24.42,84.54 24.38,84.58 22.86,84.58 22.73,84.71 U$2.14 22.73,88.14 19.95,90.92 R5.2
  Bottom 0.61: 34.8,84.54 C44.1
D+
  Bottom 0.254: U$2.4 18.4,79.74 18.16,79.5 17.78,79.5 16.26,77.98 12.57,77.98 12.57,78.5 R3.1
D-
  Bottom 0.254: U$2.3 17.98,78.94 16.51,77.47 11.82,77.47 R4.2
GND  (via drill 0.79)  (1 unrouted)
  other vias: 33.78,86.11 64.26,88.14 80.01,85.85 69.34,85.09 33.02,74.42 42.93,84.07 24.51,73.53 82.04,61.21 69.6,61.98 18.29,70.23 56.52,36.07 43.94,36.2 68.45,48.13 93.22,61.21 55.5,62.1 43.43,62.23 7.62,71.75 15.11,73.03
  pour Bottom: 55.37,89.92 54.86,89.92 53.59,91.19 52.32,92.96 50.8,94.49 49.02,96.01 45.97,98.55 42.42,100.33 38.61,101.85 35.05,102.62 31.75,103.12 27.69,103.12 22.86,102.36 18.29,100.84 14.73,99.06 12.19,97.28 9.4,95 7.37,92.71 5.33,90.17 3.05,86.36 1.52,82.8 0.76,80.01 0.25,77.22 0,72.64 0.51,66.29 1.52,61.47 3.05,56.64 5.33,51.31 9.65,43.94 14.73,37.59 20.83,30.73 27.43,24.64 36.58,16.26 42.42,11.43 48.77,5.84 53.59,1.27 55.37,-0.25 56.9,0.76 61.21,4.83 70.61,12.95 77.22,18.54 83.82,24.38 88.9,29.21 93.98,34.29 97.54,38.61 101.35,43.43 103.89,47.5 105.92,51.31 107.95,55.88 109.47,60.96 110.49,66.29 110.74,69.09 111,73.91 110.74,77.98 109.73,82.04 107.95,86.61 105.66,90.42 102.87,93.73 99.82,96.52 95.76,99.31 90.42,101.85 86.11,102.62 80.52,103.12 76.2,102.87 71.63,101.6 67.06,99.57 63.25,97.28 60.2,94.49 57.66,91.69 56.64,90.17 55.37,90.17
  pour Top: 55.88,89.92 54.86,89.92 53.59,91.19 52.32,92.96 50.8,94.49 49.02,96.01 45.97,98.55 42.42,100.33 38.61,101.85 35.05,102.62 31.75,103.12 27.69,103.12 22.86,102.36 18.29,100.84 14.73,99.06 12.19,97.28 9.4,95 7.37,92.71 5.33,90.17 3.05,86.36 1.52,82.8 0.76,80.01 0.25,77.22 0,72.64 0.51,66.29 1.52,61.47 3.05,56.64 5.33,51.31 9.65,43.94 14.73,37.59 20.83,30.73 27.43,24.64 36.58,16.26 42.42,11.43 48.77,5.84 53.59,1.27 55.37,-0.25 56.9,0.76 61.21,4.83 70.61,12.95 77.22,18.54 83.82,24.38 88.9,29.21 93.98,34.29 97.54,38.61 101.35,43.43 103.89,47.5 105.92,51.31 107.95,55.88 109.47,60.96 110.49,66.29 110.74,69.09 111,73.91 110.74,77.98 109.73,82.04 107.95,86.61 105.66,90.42 102.87,93.73 99.82,96.52 95.76,99.31 90.42,101.85 86.11,102.62 80.52,103.12 76.2,102.87 71.63,101.6 67.06,99.57 63.25,97.28 60.2,94.49 57.66,91.69 56.64,90.17
N$1
  Top 0.254: D1.2 26.85,94.06 29.97,90.93 33.67,90.93 D2.4
N$2
  Top 0.254: D2.2 42.09,94.06 42.16,93.98 43.18,93.98 53.59,83.57 57.15,83.57 64.52,90.93 71.77,90.93 D3.4
N$3
  Top 0.254: D3.2 79.43,94.06 79.5,93.98 81.42,93.98 D4.4
N$4
  Top 0.254: D5.4 98.98,78.16 100.08,79.25 104.65,79.25 105.41,80.01 105.41,84.58 95.76,94.23 89.88,94.23 D4.2
N$5
  Top 0.254: D5.2 100.41,81.36 98.81,79.76 92.2,79.76 91.69,79.25 85.64,79.25 D6.4
N$6
  Top 0.254: D6.2 87.05,81.36 86.11,82.3 85.85,82.3 84.84,83.31 82.04,83.31 82.04,82.04 79.25,79.25 72.94,79.25 D7.4
N$7
  Top 0.254: D8.4 60.24,79.25 67.31,79.25 69.09,81.03 69.09,81.28 70.36,82.55 73.15,82.55 74.35,81.36 D7.2
N$8
  Top 0.254: D8.2 64.3,81.06 61.94,81.06 60.71,82.3 60.45,82.3 60.2,82.55 55.88,82.55 54.86,81.53 54.86,79.25 50.29,79.25 49.28,78.23 46.52,78.23 D9.4
N$9
  Top 0.254: D9.2 48.95,81.36 48.01,82.3 47.75,82.3 47.5,82.55 44.45,82.55 41.15,79.25 37.34,79.25 36.32,78.23 33.82,78.23 D10.4
N$10
  Top 0.254: D10.2 36.25,81.36 35.05,82.55 31.5,82.55 30.73,81.79 30.73,79.5 30.35,79.12 22.01,79.12 D11.4
N$11
  Top 0.254: D11.2 23.55,81.36 22.35,82.55 18.29,82.55 17.78,83.06 15.62,83.06 15.11,82.55 15.11,79.88 14.86,79.63 9.82,79.63 D12.4
N$12
  Top 0.254: D12.2 13.5,83.53 13.46,83.57 13.46,85.72 12.06,87.12 11.05,87.12 10.03,88.14 5.97,88.14 4.57,86.74 4.57,66.55 5.59,65.53 8.27,65.53 D13.4
N$13
  Top 0.254: D13.2 17.84,68.66 D14.4
N$14
  Top 0.254: D14.2 30.55,68.66 D15.4
N$15
  Top 0.254: D15.2 43.24,68.66 D16.4
N$16
  Top 0.254: D16.2 55.95,68.66 D17.4
N$17
  Top 0.254: D17.2 68.64,68.66 D18.4
N$18
  Top 0.254: D18.2 81.34,68.66 D19.4
N$19
  Top 0.254: D19.2 94.05,68.66 D20.4
N$20
  Top 0.254: D20.2 102.06,68.66 100.08,66.67 100.08,62.36 97.41,59.69 95.5,59.69 95.12,59.31 95.12,57.4 95.38,57.15 97.92,57.15 98.17,56.9 103.89,56.9 103.89,55.12 103.63,54.86 100.97,54.86 98.93,52.83 97.32,52.83 D21.4
N$21
  Top 0.254: D21.2 100.53,55.96 98.3,53.72 85.51,53.72 D22.4
N$22
  Top 0.254: D22.2 87.17,55.96 85.98,57.15 82.3,57.15 78.87,53.72 75.31,53.72 74.3,52.7 71.9,52.7 D23.4
N$23
  Top 0.254: D23.2 74.6,55.96 73.53,57.02 69.47,57.02 67.06,54.61 66.55,54.61 65.91,53.98 63.5,53.98 62.61,53.09 59.48,53.09 D24.4
N$24
  Top 0.254: D25.4 49.45,52.76 50.42,53.72 56.64,53.72 57.78,54.86 61.21,54.86 62.23,55.88 64.22,55.88 D24.2
N$25
  Top 0.254: D26.4 36.75,52.76 37.72,53.72 41.91,53.72 43.18,54.99 48.64,54.99 49.66,56.01 51.55,56.01 D25.2
N$26
  Top 0.254: D27.4 22.78,52.76 23.75,53.72 28.57,53.72 29.59,54.74 35.18,54.74 36.4,55.96 D26.2
N$27
  Top 0.254: D28.4 10.62,52.76 12.32,51.05 16.13,51.05 17.53,52.45 17.53,54.99 19.68,57.15 22.23,57.15 23.37,56.01 26.15,56.01 D27.2
N$28
  Top 0.254: D28.2 10.85,55.96 10.85,55.93 9.53,54.61 6.48,54.61 6.35,54.48 6.35,52.45 7.24,51.56 9.54,51.56 D29.4
N$29
  Top 0.254: D29.2 30.55,43.26 D30.4
N$30
  Top 0.254: D30.2 43.24,43.26 D31.4
N$31
  Top 0.254: D31.2 55.95,43.26 D32.4
N$32
  Top 0.254: D32.2 68.64,43.26 D33.4
N$33
  Top 0.254: D33.2 81.34,43.26 D34.4
N$34
  Top 0.254: D34.2 91.62,43.26 92.71,42.16 92.71,39.24 89.53,36.07 72.26,36.07 71.75,35.56 71.75,32.89 73.03,31.62 78.23,31.62 78.49,31.37 78.49,29.59 78.36,29.46 75.82,29.46 73.79,27.43 71.92,27.43 D35.4
N$35
  Top 0.254: D35.2 76.15,30.56 73.91,28.32 63.25,28.32 62.23,27.3 59.2,27.3 D36.4
N$36
  Top 0.254: D36.2 61.92,30.56 60.83,29.46 54.36,29.46 53.34,28.45 50.29,28.45 49.15,27.3 46.5,27.3 D37.4
N$37
  Top 0.254: D37.2 49.45,30.56 48.26,31.75 44.96,31.75 41.53,28.32 37.59,28.32 36.7,27.43 33.82,27.43 D38.4
N$38
  Top 0.254: D38.2 36.75,30.56 35.56,31.75 29.97,31.75 29.08,30.86 29.08,25.91 36.2,18.8 38.99,18.8 43.05,14.73 46.37,14.73 D39.4
N$39
  Top 0.254: D39.2 55.95,17.86 D40.4
N$40
  Bottom 0.508: F1.2 7.36,67.69 R1.2 11.82,67.68 12.7,66.8 12.7,63.75 13.97,62.48 14.83,62.48 U$1.7 17.91,62.61 | 17.91,62.61 19.05,63.75 20.98,63.75 U$1.1 | U$1.4 18.92,60.07 18.03,60.96 18.03,62.48 17.91,62.61
N$41
  Bottom 0.254: JP1.D+ 6.91,77.01 8.89,79.5 R3.2
N$42
  Bottom 0.254: JP1.D- 5.93,76.62 6.1,76.45 7.37,76.45 8.64,77.72 R4.1
N$43  (via drill 0.79)
  Top 0.254: v13.97,87.63 15.24,87.63 v17.02,89.41
  Bottom 0.254: ISP.P$5 12.63,88.97 v13.97,87.63 | v17.02,89.41 17.02,90.05 R5.1 18.15,90.31 19.81,88.65 21.34,88.65 21.84,88.14 21.84,87.23 U$2.13
N$44
  Bottom 0.254: U$2.42 22.73,72.41 C46.1
N$45
  Bottom 0.254: LED1.C 14.77,64.08 U$1.8
N$46
  Bottom 0.254: R1.1 12.55,69.48 LED1.A
N$47
  Bottom 0.254: LED2.A R2.1
N$48
  Bottom 0.254: U$2.6 18.35,81.34 18.29,81.28 17.78,81.28 17.02,80.52 15.38,80.52 C47.1
N$49
  Bottom 0.254: C48.1 27.9,93.1 | 27.9,93.1 Y1.3 | 27.9,93.1 25.28,93.1 25.15,92.96 25.15,87.16 U$2.17
N$50
  Bottom 0.254: Y1.1 19.56,98.3 23.11,94.74 C49.1 24.25,93.1 24.38,92.96 24.38,87.2 U$2.16
N$51
  Bottom 0.254: ISP.P$1 15.43,89.25 U$2.11
N$52  (via drill 0.79)
  Top 0.254: v14.99,84.33 v16.76,86.11
  Bottom 0.254: U$2.9 15.57,83.74 v14.99,84.33 | v16.76,86.11 16.76,86.87 14.73,88.9 14.73,89.66 ISP.P$3
N$53
  Bottom 0.254: U$2.10 16.55,84.54 14.73,86.36 8.89,86.36 6.6,88.65 6.86,90.42 10.41,93.98 | 10.41,93.98 | 10.41,93.98 ISP.P$4
N$54
  Bottom 0.254: LED3.A R6.1
N$55
  Bottom 0.254: U$2.22 32.79,87.14 36.32,90.68 R6.2
N$57
  Bottom 0.254: LED4.A R7.1
N$58
  Bottom 0.254: R7.2 12.08,84.44 13.72,82.8 19.19,82.8 U$2.8
PC6  (via drill 0.79)
  Top 0.254: v36.58,87.63 32.51,87.63 30.99,89.15 22.75,89.15 D1.4
  Bottom 0.254: U$2.31 32.46,78.94 33.02,79.5 35.05,79.5 39.12,83.57 39.12,84.07 v36.58,87.63
UVCC  (via drill 0.79)  (2 unrouted)
  Top 0.508: v16.38,81.66 16.51,77.72 v18.8,75.44
  Bottom 0.508: 17.27,77.22 18.2,78.14 U$2.2 | 17.27,77.22 16.51,76.45 | 6.35,74.68 6.35,73.28 F1.1 | 6.35,74.68 11.68,74.68 13.72,76.71 15.89,76.71 C45.2 | U$2.7 17.12,82.14 v16.38,81.66 | v18.8,75.44 18.8,75.69 17.27,77.22 | 6.35,74.68 6.35,75.18 5.71,75.82
VBAT
  Bottom 0.508: CN1.1 12.7,48.22 12.7,48.26 11.05,49.91 C41.A 11.05,53.47 11.94,54.36 11.94,55.41 U1.3 12.03,55.37 13.72,55.37 14.22,55.88 14.22,56.64 13.53,57.34 U1.1 14.7,60.07 U$1.5